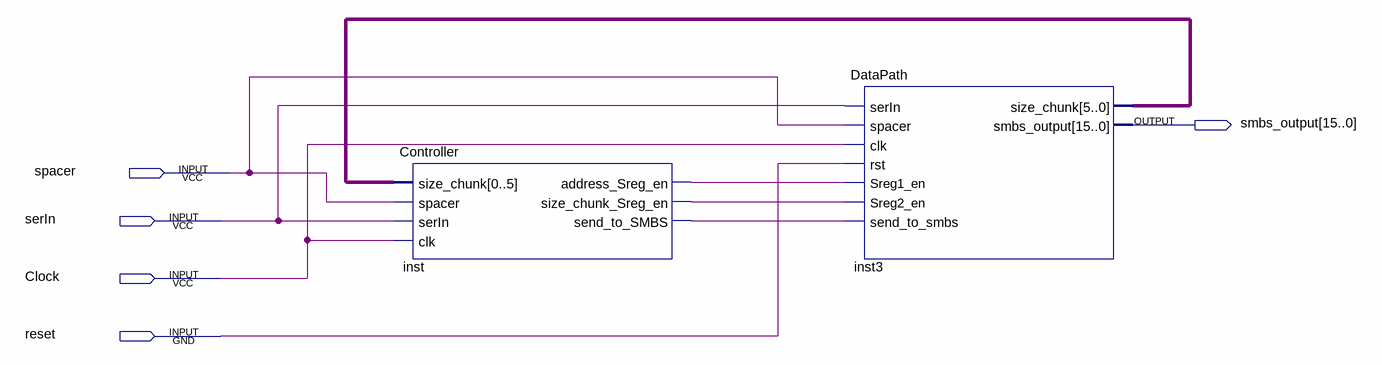
[diagram p0: schematic sheet]
// Quartus schematic CA5_Quartus.bdf as structural Verilog: 2 symbols, 5 pins
module CA5_Quartus (
  input  spacer,
  input  serIn,
  input  Clock,
  input  reset,
  output [15:0] smbs_output
);

  wire inst_address_sreg_en, inst_send_to_smbs, inst_size_chunk_sreg_en;
  wire [5:0] inst3_size_chunk;

  Controller inst (
    .size_chunk(inst3_size_chunk), .spacer(spacer), .serIn(serIn), .clk(Clock),
    .address_Sreg_en(inst_address_sreg_en), .size_chunk_Sreg_en(inst_size_chunk_sreg_en),
    .send_to_SMBS(inst_send_to_smbs));
  DataPath inst3 (
    .serIn(serIn), .spacer(spacer), .clk(Clock), .rst(reset), .Sreg1_en(inst_address_sreg_en),
    .Sreg2_en(inst_size_chunk_sreg_en), .send_to_smbs(inst_send_to_smbs), .size_chunk(inst3_size_chunk),
    .smbs_output(smbs_output));
endmodule
